# EAGLE design TWE-Lite_USB (EAGLE 7.4.0)
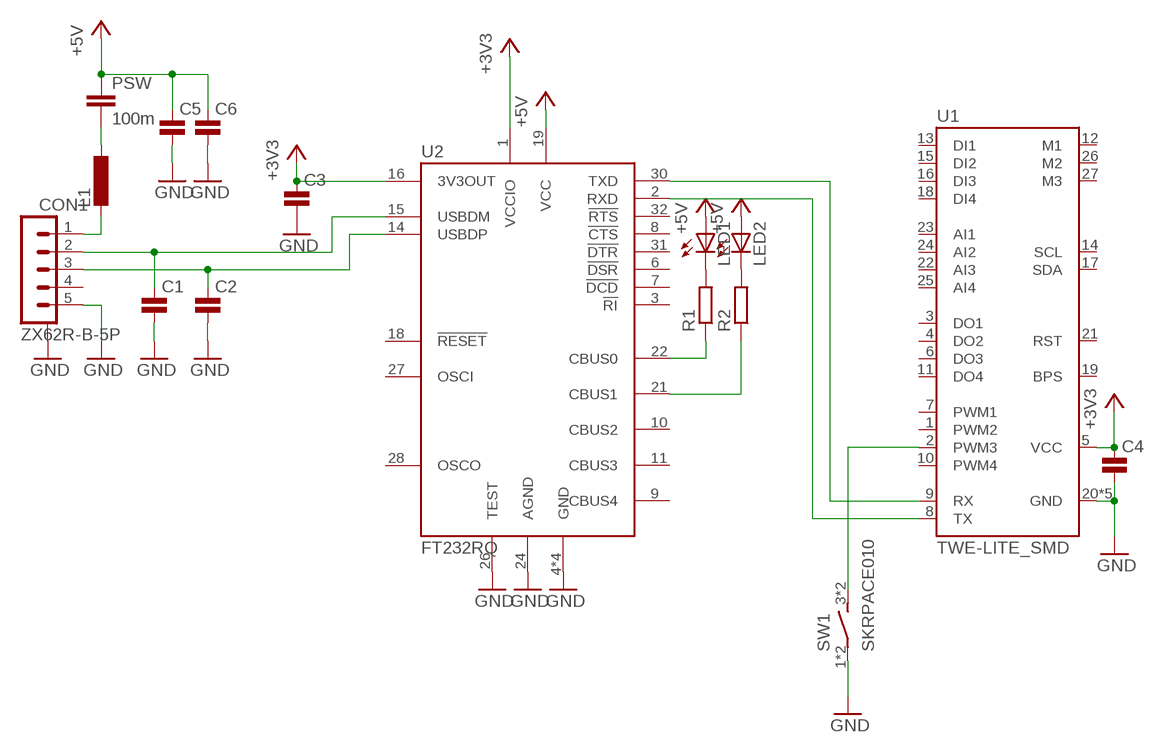
[diagram p0: schematic, sheet 1]

## Parts
C1  C0402  [0402]
C2  C0402  [0402]
C3  C0402  [0402]
C4  C0402  [0402]
C5  C0402  [0402]
C6  C0402  [0402]
CON1  ZX62R-B-5P  [MICRO-B]
L1  L-EU  [C0603K]
LED1  LEDSML0603  [SML0603]
LED2  LEDSML0603  [SML0603]
PSW  100m  C-EUC3225  [C3225]
R1  R-EU_R0402  [R0402]
R2  R-EU_R0402  [R0402]
SW1  SKRPACE010  [SKRPACE010]
U1  TWE-LITE_SMD  [LITE]
U2  FT232RQ  [QFN32]

## Nets
+3V3: C3.1 C4.1 U1.5(VCC) U2.1(VCCIO) U2.16(3V3OUT)
+5V: C5.1 C6.1 LED1.A LED2.A PSW.1 U2.19(VCC)
GND: C1.2 C2.2 C3.2 C4.2 C5.2 C6.2 CON1.5(1.VBUS) CON1.CASE@1 CON1.CASE@2 CON1.CASE@3 CON1.CASE@4 SW1.1(P) SW1.2(P) U1.20(GND) U1.28(GND) U1.30(GND) U1.31(GND) U1.32(GND) U2.4(GND) U2.17(GND) U2.20(GND) U2.24(AGND) U2.26(TEST) U2.PAD(GND)
N$1: C1.1 CON1.2(4.ID) U2.15(USBDM)
N$2: C2.1 CON1.3(3.D+) U2.14(USBDP)
N$3: CON1.1(5.GND) L1.2
N$4: LED1.C R1.2
N$5: U1.9(RX) U2.30(TXD)
N$6: U1.8(TX) U2.2(RXD)
N$7: SW1.3(S) SW1.4(S) U1.2(PWM3)
N$8: L1.1 PSW.2
N$9: LED2.C R2.2
N$10: R1.1 U2.22(CBUS0)
N$11: R2.1 U2.21(CBUS1)
Unconnected: CON1.4(2.D-) U1.1(PWM2) U1.3(DO1) U1.4(DO2) U1.6(DO3) U1.7(PWM1) U1.10(PWM4) U1.11(DO4) U1.12(M1) U1.13(DI1) U1.14(SCL) U1.15(DI2) U1.16(DI3) U1.17(SDA) U1.18(DI4) U1.19(BPS) U1.21(RST) U1.22(AI3) U1.23(AI1) U1.24(AI2) U1.25(AI4) U1.26(M2) U1.27(M3) U2.3(!RI!) U2.6(!DSR!) U2.7(!DCD!) U2.8(!CTS!) U2.9(CBUS4) U2.10(CBUS2) U2.11(CBUS3) U2.18(!RESET!) U2.27(OSCI) U2.28(OSCO) U2.31(!DTR!) U2.32(!RTS!)

## Library data of the parts
C1-C6 = untitled:C: CAPACITOR
CON1 = untitled:ZX62R-B-5P
L1 = rcl:L-EU: INDUCTOR, European symbol
LED1 LED2 = led:LED: LED OSRAM: - CHIPLED LG R971, LG N971, LY N971, LG Q971, LY Q971, LO R971, LY R971 LH N974, LH R974 LS Q976, LO Q976, LY Q976 LO Q996 - Hyper CHIPLED LW Q18S LB Q993, LB Q99A, LB R99A - SideLED LS A670, LO A670, LY A670, LG A670, LP A670 LB A673, LV A673, LT A673, LW A673 LH A674 LY A675 LS A676, LA A676, LO A676, LY A676, LW A676 LS A679, LY A679, LG A679 - Hyper Micro SIDELED® LS Y876, LA Y876, LO Y876, LY Y876 LT Y87S - SmartLED LW L88C, LW L88S LB L89C, LB L89S, LG L890 LS L89K, LO L89K, LY L89K LS L896, LA L896, LO L896, LY L896 - TOPLED LS T670, LO T670, LY T670, LG T670, LP T670 LSG T670, LSP T670, LSY T670, LOP T670, LYG T670 LG T671, LOG T671, LSG T671 LB T673, LV T673, LT T673, LW T673 LH T674 LS T676, LA T676, LO T676, LY T676, LB T676, LH T676, LSB T676, LW T676 LB T67C, LV T67C, LT T67C, LS T67K, LO T67K, LY T67K, LW E67C LS E67B, LA E67B, LO E67B, LY E67B, LB E67C, LV E67C, LT E67C LW T67C LS T679, LY T679, LG T679 LS T770, LO T770, LY T770, LG T770, LP T770 LB T773, LV T773, LT T773, LW T773 LH T774 LS E675, LA E675, LY E675, LS T675 LS T776, LA T776, LO T776, LY T776, LB T776 LHGB T686 LT T68C, LB T68C - Hyper Mini TOPLED® LB M676 - Mini TOPLED Santana® LG M470 LS M47K, LO M47K, LY M47K Source: http://www.osram.convergy.de LUXEON: - LUMILED® LXK2-PW12-R00, LXK2-PW12-S00, LXK2-PW14-U00, LXK2-PW14-V00 LXK2-PM12-R00, LXK2-PM12-S00, LXK2-PM14-U00 LXK2-PE12-Q00, LXK2-PE12-R00, LXK2-PE12-S00, LXK2-PE14-T00, LXK2-PE14-U00 LXK2-PB12-K00, LXK2-PB12-L00, LXK2-PB12-M00, LXK2-PB14-N00, LXK2-PB14-P00, LXK2-PB14-Q00 LXK2-PR12-L00, LXK2-PR12-M00, LXK2-PR14-Q00, LXK2-PR14-R00 LXK2-PD12-Q00, LXK2-PD12-R00, LXK2-PD12-S00 LXK2-PH12-R00, LXK2-PH12-S00 LXK2-PL12-P00, LXK2-PL12-Q00, LXK2-PL12-R00 Source: www.luxeon.com KINGBRIGHT: KA-3528ASYC Source: www.kingbright.com
PSW = rcl:C-EU: CAPACITOR, European symbol
R1 R2 = rcl:R-EU_: RESISTOR, European symbol
SW1 = untitled:SKRPACE010
U1 = untitled:TWE-LITE
U2 = untitled:FT232R

## Board
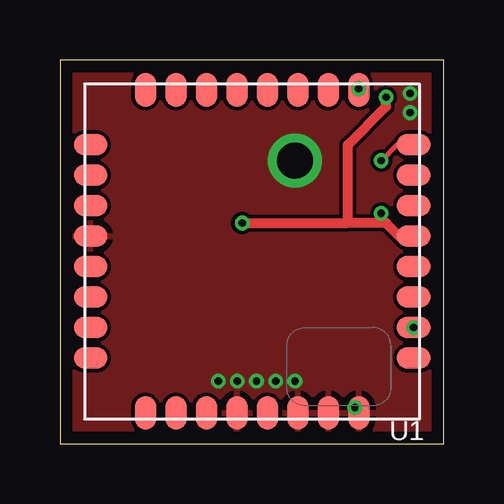
[diagram p1: board, top side]
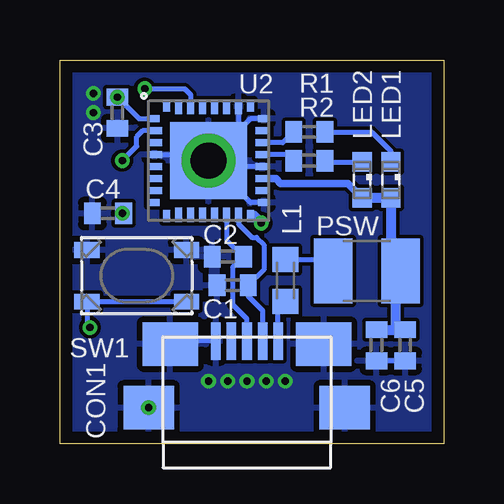
[diagram p2: board, bottom side, seen from below]

Size 16 x 16 mm. Coordinates in mm from the lower left corner, seen from the top.
Outline: 0,0 16,0 16,16 0,16 0,0
Copper layers (1*16): Top 0.035mm / dielectric 1.6mm / Bottom 0.035mm
Design rules "Elecrow_2-layer_PCB_eagle_rule *": minimum track width 6mil, minimum drill 12mil, track to track 6mil, track to pad 6mil, pad to pad 6mil, via to via 8mil, smd to smd 0mil, copper to edge 20mil, drill to drill 10mil, minimum pad ring 6mil, minimum via ring 6mil, stop-mask expansion 0mil, vias tented up to drill 100mil, thermal gap 10mil

### Footprints (pad centres in the part's own frame; a part is rotated, then mirrored left to right if it is on the bottom)
0402 = smd 0.7 x 0.9: 1 -0.65,0; 2 0.65,0
MICRO-B = smd 0.4 x 1.55: 1 1.3,2.775; 2 0.65,2.775; 3 0,2.775; 4 -0.65,2.775; 5 -1.3,2.775 | smd 2.3 x 1.8: CASE@1 -3.2,2.65; CASE@2 3.2,2.65 | smd 2.1 x 1.8: CASE@3 -4.1,0; CASE@4 4.075,0
C0603K = smd 1.05 x 1.08: 1 -0.875,0; 2 0.875,0
SML0603 = smd 0.8 x 0.8: A 0.75,0; C -0.75,0
C3225 = smd 1.6 x 2.7: 1 -1.4,0; 2 1.4,0
R0402 = smd 0.7 x 0.9: 1 -0.65,0; 2 0.65,0
SKRPACE010 = smd 1.05 x 0.65: 1 -2.075,1.075; 2 2.075,1.075; 3 -2.075,-1.075; 4 2.075,-1.075
LITE = smd 1.4 x 0.9: 1 0.25,11.43; 2 0.25,10.16; 3 0.25,8.89; 4 0.25,7.62; 5 0.25,6.35; 6 0.25,5.08; 7 0.25,3.81; 8 0.25,2.54; 17 13.72,2.54; 18 13.72,3.81; 19 13.72,5.08; 20 13.72,6.35; 21 13.72,7.62; 22 13.72,8.89; 23 13.72,10.16; 24 13.72,11.43 | smd 0.9 x 1.4: 9 2.54,0.25; 10 3.81,0.25; 11 5.08,0.25; 12 6.35,0.25; 13 7.62,0.25; 14 8.89,0.25; 15 10.16,0.25; 16 11.43,0.25; 25 11.43,13.72; 26 10.16,13.72; 27 8.89,13.72; 28 7.62,13.72; 29 6.35,13.72; 30 5.08,13.72; 31 3.81,13.72; 32 2.54,13.72
QFN32 = smd 0.5 x 0.3: 1 -2.3,1.75; 8 -2.3,-1.75; 17 2.3,-1.75; 24 2.3,1.75 | smd 0.6 x 0.3: 2 -2.25,1.25; 3 -2.25,0.75; 4 -2.25,0.25; 5 -2.25,-0.25; 6 -2.25,-0.75; 7 -2.25,-1.25; 18 2.25,-1.25; 19 2.25,-0.75; 20 2.25,-0.25; 21 2.25,0.25; 22 2.25,0.75; 23 2.25,1.25 | smd 0.3 x 0.5: 9 -1.75,-2.3; 16 1.75,-2.3; 25 1.75,2.3; 32 -1.75,2.3 | smd 0.3 x 0.6: 10 -1.25,-2.25; 11 -0.75,-2.25; 12 -0.25,-2.25; 13 0.25,-2.25; 14 0.75,-2.25; 15 1.25,-2.25; 26 1.25,2.25; 27 0.75,2.25; 28 0.25,2.25; 29 -0.25,2.25; 30 -0.75,2.25; 31 -1.25,2.25 | smd 3.2 x 3.2: PAD 0,0

### Placement (x,y rotation side)
C1  8.8,6.6 180 bottom
C2  9,7.8 180 bottom
C3  13.6,13.8 270 bottom
C4  14,9.6 180 bottom
C5  1.6,4.1 270 bottom
C6  2.8,4.1 270 bottom
CON1  8.2,1.5 0 bottom
L1  6.6,6.8 270 bottom
LED1  2.2,11 270 bottom
LED2  3.4,11 270 bottom
PSW  3.2,7.2 180 bottom
R1  5.6,13 0 bottom
R2  5.6,11.8 0 bottom
SW1  12.8,7 0 bottom
U1  15,15 180 top
U2  9.8,11.8 0 bottom

### Tracks (layer width: path | path; a pad name or v marks a point on that pad's centre or on a via)
+3V3  (via drill 0.3)
  Top 0.203: 14.7,8.6 U1.5 | v13.4,9.6 13.4,9.2
  Top 0.406: v7.6,9.2 12,9.2 | 14.7,8.6 14.2,8.6 13.6,9.2 13.4,9.2 12,9.2 | 12,9.2 12,12.45 13.6,14.05 C3.1
  Bottom 0.203: U2.16 7.9,9.5 | C3.1 12.7,13.55 U2.1 | v13.4,9.6 C4.1
  Bottom 0.406: 7.9,9.5 v7.6,9.2
  other vias: 13.6,14.45
+5V
  Bottom 0.203: 2,7.2 PSW.1 2.2,7.6
  Bottom 0.305: LED2.A 4,10.85 6.8,10.85 7,11.05 U2.19
  Bottom 0.406: C6.1 C5.1 2,4.75 2,7.2 | LED2.A LED1.A 2.2,7.6
GND  (via drill 0.3, 1.5)
  Top 0.203: U1.32 12.3,1.28 CON1.CASE@3
  Bottom 0.203: C5.2 C6.2 | U2.20 9.8,11.55 U2.PAD | U2.26 8.55,11.8 U2.PAD | U2.24 8.05,13.55 U2.PAD | U2.4 9.8,12.05 U2.PAD | U2.17 8.05,10.05 U2.PAD | CON1.5 11.4,4.28 11.4,4.2
  other vias: 12.3,1.5 14.6,14.6 14.6,13.8 9.8,11.8 9.8,2.6 9,2.6 8.2,2.6 6.6,2.6 7.4,2.6
  pour Bottom: 0,16 16,16 16,0 0,0
  pour Top: 0,16 16,16 16,0 0,0
N$1
  Bottom 0.203: U2.15 8.55,9.15 8,8.6 7.8,8.6 7.5,8.3 7.5,7.25 C1.1 8.15,6.15 7.55,5.55 CON1.2
N$2
  Bottom 0.203: CON1.3 8.2,5.2 8.8,5.8 8.8,7.35 C2.1 9.05,8.5 U2.14
N$3
  Bottom 0.203: CON1.1 6.9,5.92 L1.2
N$4
  Bottom 0.203: R1.2 3,13 2.2,12.2 LED1.C
N$5  (via drill 0.3)
  Top 0.203: U1.9 v12.46,14.8
  Bottom 0.203: v12.46,14.8 10.8,14.8 10.55,14.55 U2.30
N$6  (via drill 0.3)
  Top 0.203: U1.8 14.06,12.46 v13.4,11.8
  Bottom 0.203: U2.2 12.55,13.05 12.8,12.8 12.8,12.4 v13.4,11.8
N$7  (via drill 0.3)
  Top 0.203: U1.2 14.88,4.96
  Bottom 0.203: U1.2 14.88,4.84 SW1.3 SW1.4
  other vias: 14.75,4.84
N$8
  Bottom 0.203: L1.1 5.08,7.67 PSW.2
N$9
  Bottom 0.203: R2.2 4.9,11.75 LED2.C
N$10
  Bottom 0.203: R1.1 6.7,12.55 U2.22
N$11
  Bottom 0.203: R2.1 6.5,12.05 U2.21

### Text on the board
_tNames: U1
_bNames: LED1 | LED2 | R1 | U2 | R2 | C3 | C4 | L1 | PSW | C2 | C1 | SW1 | C5 | C6 | CON1